# EAGLE design Executive_12V_A (EAGLE 9.5.1)
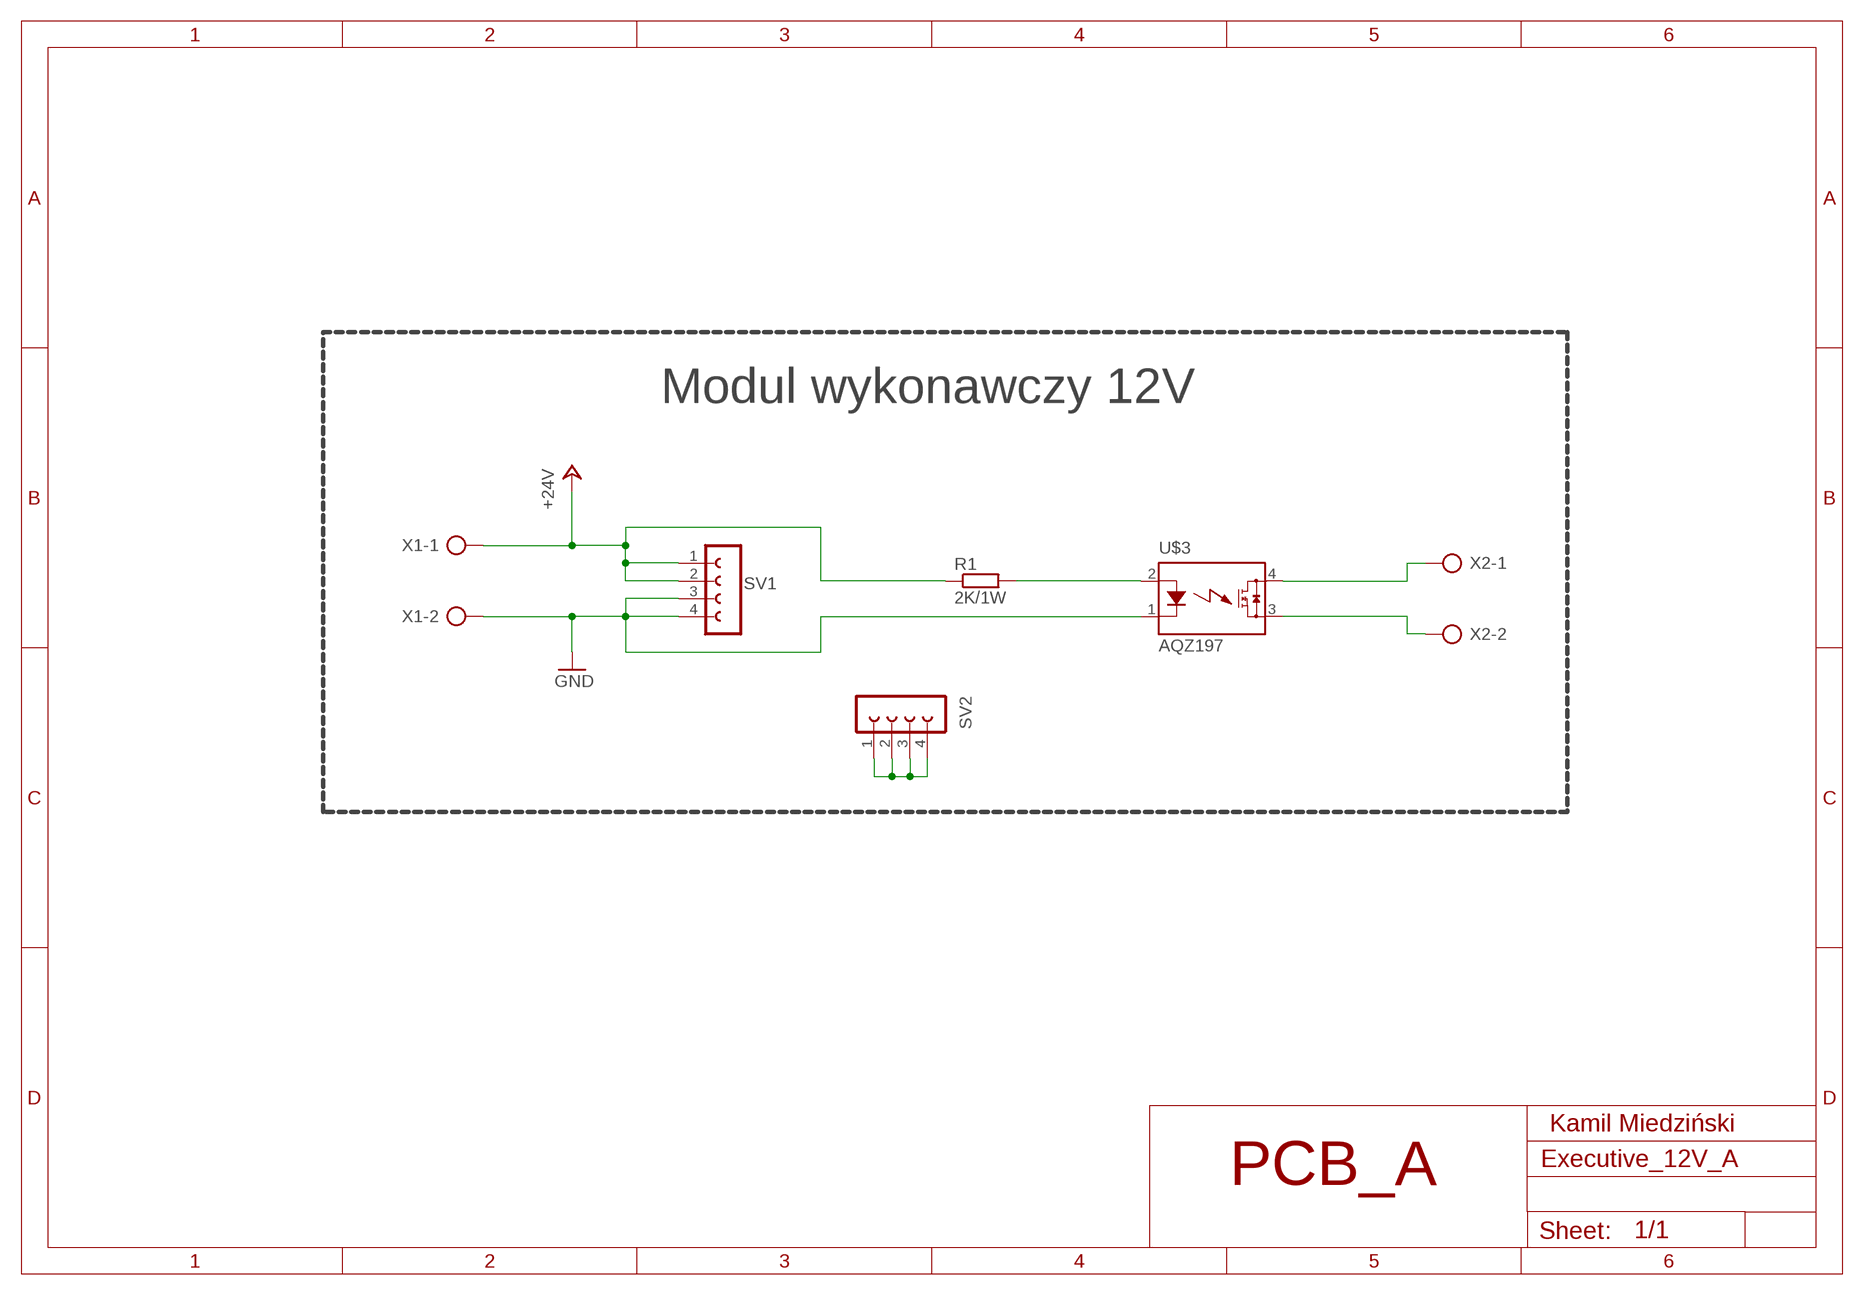
[diagram p0: schematic, sheet 1]

## Parts
R1  2K/1W  R-EU_0411/15  [0411/15]
SV1  FE04-1  [FE04-1]
SV2  FE04-1  [FE04-1]
U$3  AQZ197  [AQZ-SIL04]
X1  GMKDSP_3/2  [GMKDSP_3/2]
X2  GMKDSP_3/2  [GMKDSP_3/2]

## Nets
+24V: R1.1 SV1.1 SV1.2 X1.1
GND: SV1.3 SV1.4 U$3.1(K) X1.2
N$1: U$3.4(DS1) X2.1
N$2: R1.2 U$3.2(A)
N$3: U$3.3(DS2) X2.2
N$5: SV2.1 SV2.2 SV2.3 SV2.4

## Notes on the sheet
- Modul wykonawczy 12V
- Kamil Miedziński
- PCB_A

## Library data of the parts
R1 = rcl:R-EU_: RESISTOR, European symbol; SPICEPREFIX: R
SV1 SV2 = con-lsta:FE04-1: FEMALE HEADER; OC_FARNELL: unknown; OC_NEWARK: unknown
U$3 = relay:AQZ197
X1 X2 = con-ptr500:GMKDSP_3/2: CONNECTOR; OC_FARNELL: unknown; OC_NEWARK: unknown

## Board
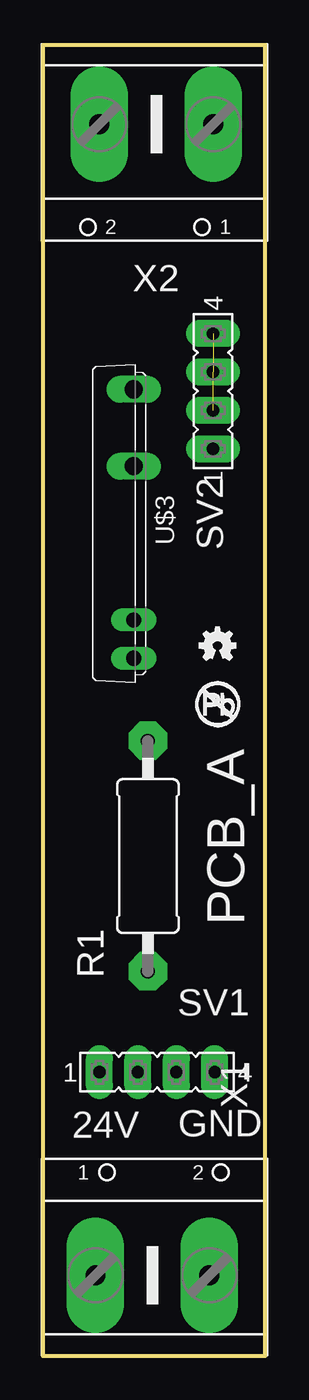
[diagram p1: board, top side]
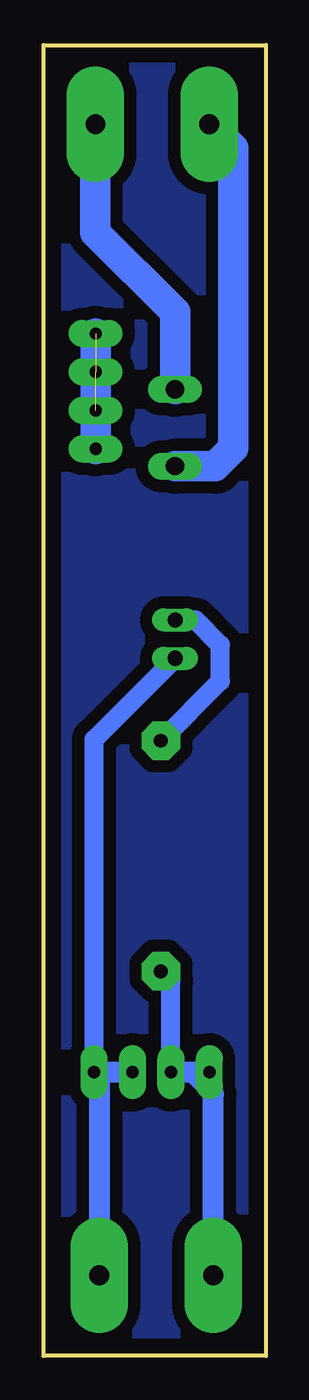
[diagram p2: board, bottom side, seen from below]

Size 14.68 x 86.64 mm. Coordinates in mm from the lower left corner, seen from the top.
Outline: 0,86.64 0,0 14.68,0 14.68,86.64 0,86.64
Copper layers (1*16): Top 0.035mm / dielectric 1.5mm / Bottom 0.035mm
Design rules "default": minimum track width 6mil, minimum drill 0.35mm, track to track 6mil, track to pad 6mil, pad to pad 6mil, via to via 6mil, smd to smd 6mil, copper to edge 40mil, drill to drill 6mil, minimum pad ring 10mil, minimum via ring 8mil, stop-mask expansion 4mil, vias tented up to drill 0mil, thermal gap 10mil

### Footprints (pad centres in the part's own frame; a part is rotated, then mirrored left to right if it is on the bottom)
0411/15 = drill 0.914 pad 2.54 octagon: 1 -7.62,0; 2 7.62,0
FE04-1 = drill 0.813 pad 1.778 long: 1 -3.81,0; 2 -1.27,0; 3 1.27,0; 4 3.81,0
AQZ-SIL04 = drill 1 long: 1 -8.89,0; 2 -6.35,0 | drill 1.2 long: 3 3.81,0; 4 8.89,0
GMKDSP_3/2 = drill 1.321 pad 3.81 long: 1 -3.765,0; 2 3.765,0

### Placement (x,y rotation side)
R1  6.94,33.04 90 top
SV1  7.54,18.75 0 top
SV2  11.24,63.76 90 top
U$1  [NO_PB_LOGO_0.120]  9.83,41.18 0 top
U$2  [OSHW-LOGO-MINI]  11.54,46.96 0 top
U$3  6,55 90 top
X1  7.24,5.33 0 top
X2  7.49,81.41 180 top

### Tracks (layer width: path | path; a pad name or v marks a point on that pad's centre or on a via)
+24V
  Bottom 1.27: 3.47,17.32 4.91,18.75 | SV1.2 6.27,24.76 R1.1
  Bottom 1.4: SV1.1 4.91,18.75 SV1.2 | X1.1 3.47,17.32
GND
  Bottom 1.27: SV1.4 11.35,40.76 U$3.1
  Bottom 1.4: SV1.3 SV1.4 11,18.41 X1.2
N$1
  Bottom 2: U$3.4 6,69 11.26,74.26 X2.1
N$2
  Bottom 1.27: R1.2 3,44.6 3,47 4.65,48.65 U$3.2
N$3
  Bottom 2: X2.2 2.14,79.82 2.14,60 3.33,58.81 U$3.3
N$4
  pour Bottom (isolate 0.813): 14.68,0 0,0 0,86.64 14.68,86.64
N$5  (2 unrouted)
  Bottom 2: SV2.4 SV2.1

### Text on the board
tNames: PCB_A | 24V | GND